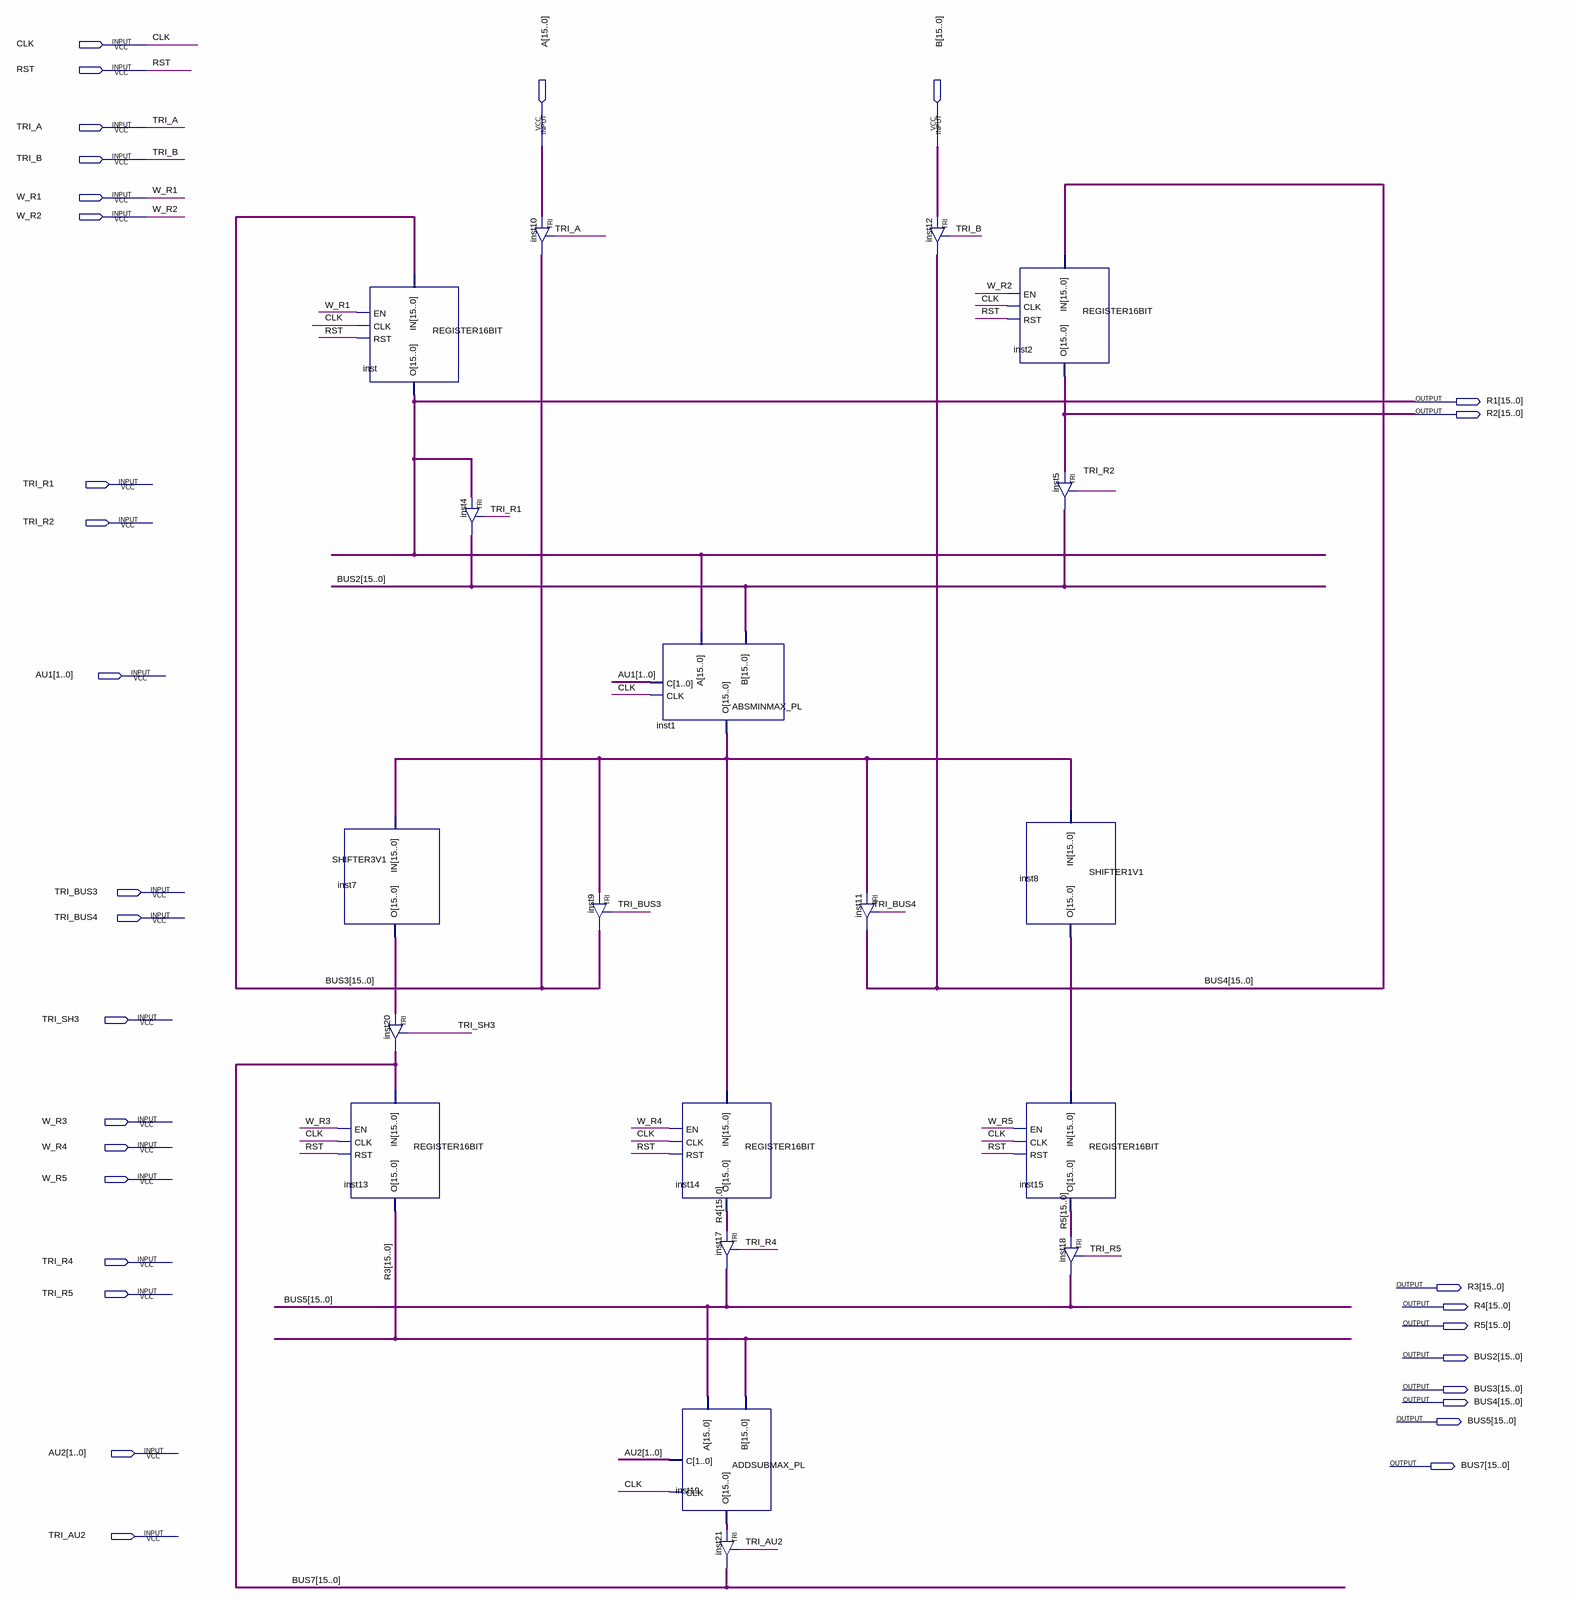
[diagram p0: schematic sheet]
// Quartus schematic DATAPATH_PL_AU_PL.bdf as structural Verilog: 19 symbols, 31 pins
module DATAPATH_PL_AU_PL (
  input  CLK,
  input  RST,
  input  TRI_A,
  input  [15:0] A,
  input  [15:0] B,
  input  TRI_B,
  input  W_R1,
  input  W_R2,
  input  TRI_R1,
  input  TRI_R2,
  input  [1:0] AU1,
  input  TRI_BUS3,
  input  TRI_BUS4,
  input  TRI_SH3,
  input  W_R3,
  input  W_R4,
  input  W_R5,
  input  TRI_R4,
  input  TRI_R5,
  input  [1:0] AU2,
  input  TRI_AU2,
  output [15:0] R1,
  output [15:0] R2,
  output [15:0] R3,
  output [15:0] R4,
  output [15:0] R5,
  output [15:0] BUS2,
  output [15:0] BUS3,
  output [15:0] BUS4,
  output [15:0] BUS5,
  output [15:0] BUS7
);

  wire [15:0] inst1_o, inst7_o, inst8_o, inst19_o;

  SHIFTER3V1 inst7 (.IN(inst1_o), .O(inst7_o));
  REGISTER16BIT inst13 (.IN(BUS7), .EN(W_R3), .CLK(CLK), .RST(RST), .O(R3));
  REGISTER16BIT inst (.IN(BUS3), .EN(W_R1), .CLK(CLK), .RST(RST), .O(R1));
  TRI inst20[15:0] (.IN(inst7_o), .OE(TRI_SH3), .OUT(BUS7));
  TRI inst4[15:0] (.IN(R1), .OE(TRI_R1), .OUT(BUS2));
  TRI inst10[15:0] (.IN(A), .OE(TRI_A), .OUT(BUS3));
  TRI inst9[15:0] (.IN(inst1_o), .OE(TRI_BUS3), .OUT(BUS3));
  ABSMINMAX_PL inst1 (.A(R1), .B(BUS2), .C(AU1), .CLK(CLK), .O(inst1_o));
  REGISTER16BIT inst14 (.IN(inst1_o), .EN(W_R4), .CLK(CLK), .RST(RST), .O(R4));
  ADDSUBMAX_PL inst19 (.A(BUS5), .B(R3), .C(AU2), .CLK(CLK), .O(inst19_o));
  TRI inst17[15:0] (.IN(R4), .OE(TRI_R4), .OUT(BUS5));
  TRI inst21[15:0] (.IN(inst19_o), .OE(TRI_AU2), .OUT(BUS7));
  TRI inst11[15:0] (.IN(inst1_o), .OE(TRI_BUS4), .OUT(BUS4));
  TRI inst12[15:0] (.IN(B), .OE(TRI_B), .OUT(BUS4));
  REGISTER16BIT inst2 (.IN(BUS4), .EN(W_R2), .CLK(CLK), .RST(RST), .O(R2));
  TRI inst5[15:0] (.IN(R2), .OE(TRI_R2), .OUT(BUS2));
  SHIFTER1V1 inst8 (.IN(inst1_o), .O(inst8_o));
  REGISTER16BIT inst15 (.IN(inst8_o), .EN(W_R5), .CLK(CLK), .RST(RST), .O(R5));
  TRI inst18[15:0] (.IN(R5), .OE(TRI_R5), .OUT(BUS5));
endmodule
